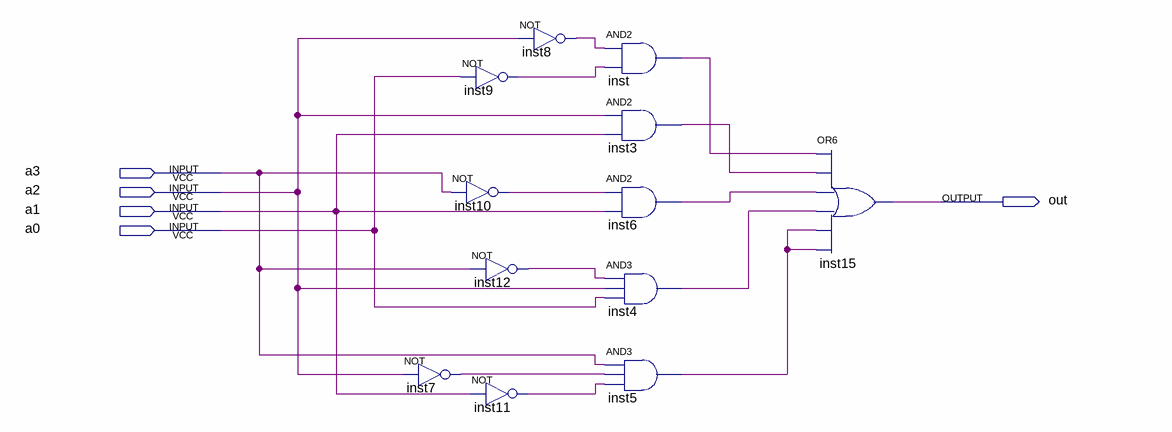
[diagram p0: schematic sheet]
// Quartus schematic FuncA.bdf as structural Verilog: 12 symbols, 5 pins
module FuncA (
  input  a3,
  input  a2,
  input  a1,
  input  a0,
  output out
);

  wire inst3_out, inst4_out, inst5_out, inst6_out, inst7_out, inst8_out, inst9_out, inst10_out, inst11_out,
       inst12_out, inst_out;

  not inst7 (inst7_out, a2);
  not inst9 (inst9_out, a0);
  not inst10 (inst10_out, a3);
  not inst12 (inst12_out, a3);
  not inst11 (inst11_out, a1);
  not inst8 (inst8_out, a2);
  and inst (inst_out, inst8_out, inst9_out);
  and inst3 (inst3_out, a2, a1);
  and inst6 (inst6_out, inst10_out, a1);
  and inst4 (inst4_out, inst12_out, a2, a0);
  and inst5 (inst5_out, a3, inst7_out, inst11_out);
  or inst15 (out, inst_out, inst3_out, inst6_out, inst4_out, inst5_out, inst5_out);
endmodule
